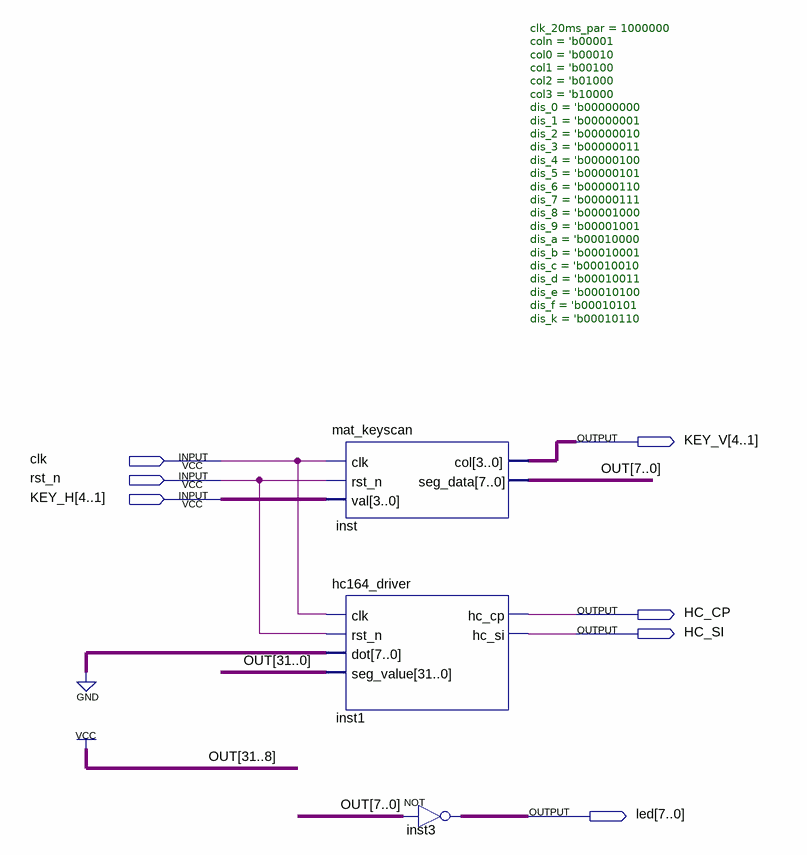
[diagram p0: schematic sheet]
// Quartus schematic keyScan(1).bdf as structural Verilog: 3 symbols, 7 pins
module \keyScan(1)  (
  input  clk,
  input  rst_n,
  input  [4:1] KEY_H,
  output [4:1] KEY_V,
  output HC_CP,
  output HC_SI,
  output [7:0] led
);

  wire [7:0] OUT;

  mat_keyscan #(.clk_20ms_par(1000000), .coln('b00001), .col0('b00010), .col1('b00100), .col2('b01000), .col3('b10000), .dis_0('b00000000), .dis_1('b00000001), .dis_2('b00000010), .dis_3('b00000011), .dis_4('b00000100), .dis_5('b00000101), .dis_6('b00000110), .dis_7('b00000111), .dis_8('b00001000), .dis_9('b00001001), .dis_a('b00010000), .dis_b('b00010001), .dis_c('b00010010), .dis_d('b00010011), .dis_e('b00010100), .dis_f('b00010101), .dis_k('b00010110)) inst (
    .clk(clk), .rst_n(rst_n), .val(KEY_H), .col(KEY_V), .seg_data(OUT));
  hc164_driver inst1 (
    .clk(clk), .rst_n(rst_n), .dot({8{1'b0}}), .seg_value({{24{1'b1}}, OUT}), .hc_cp(HC_CP), .hc_si(HC_SI));
  assign led = ~OUT;  // NOT inst3, 8 bits wide
endmodule
